# EAGLE design t (EAGLE 7.1.0)
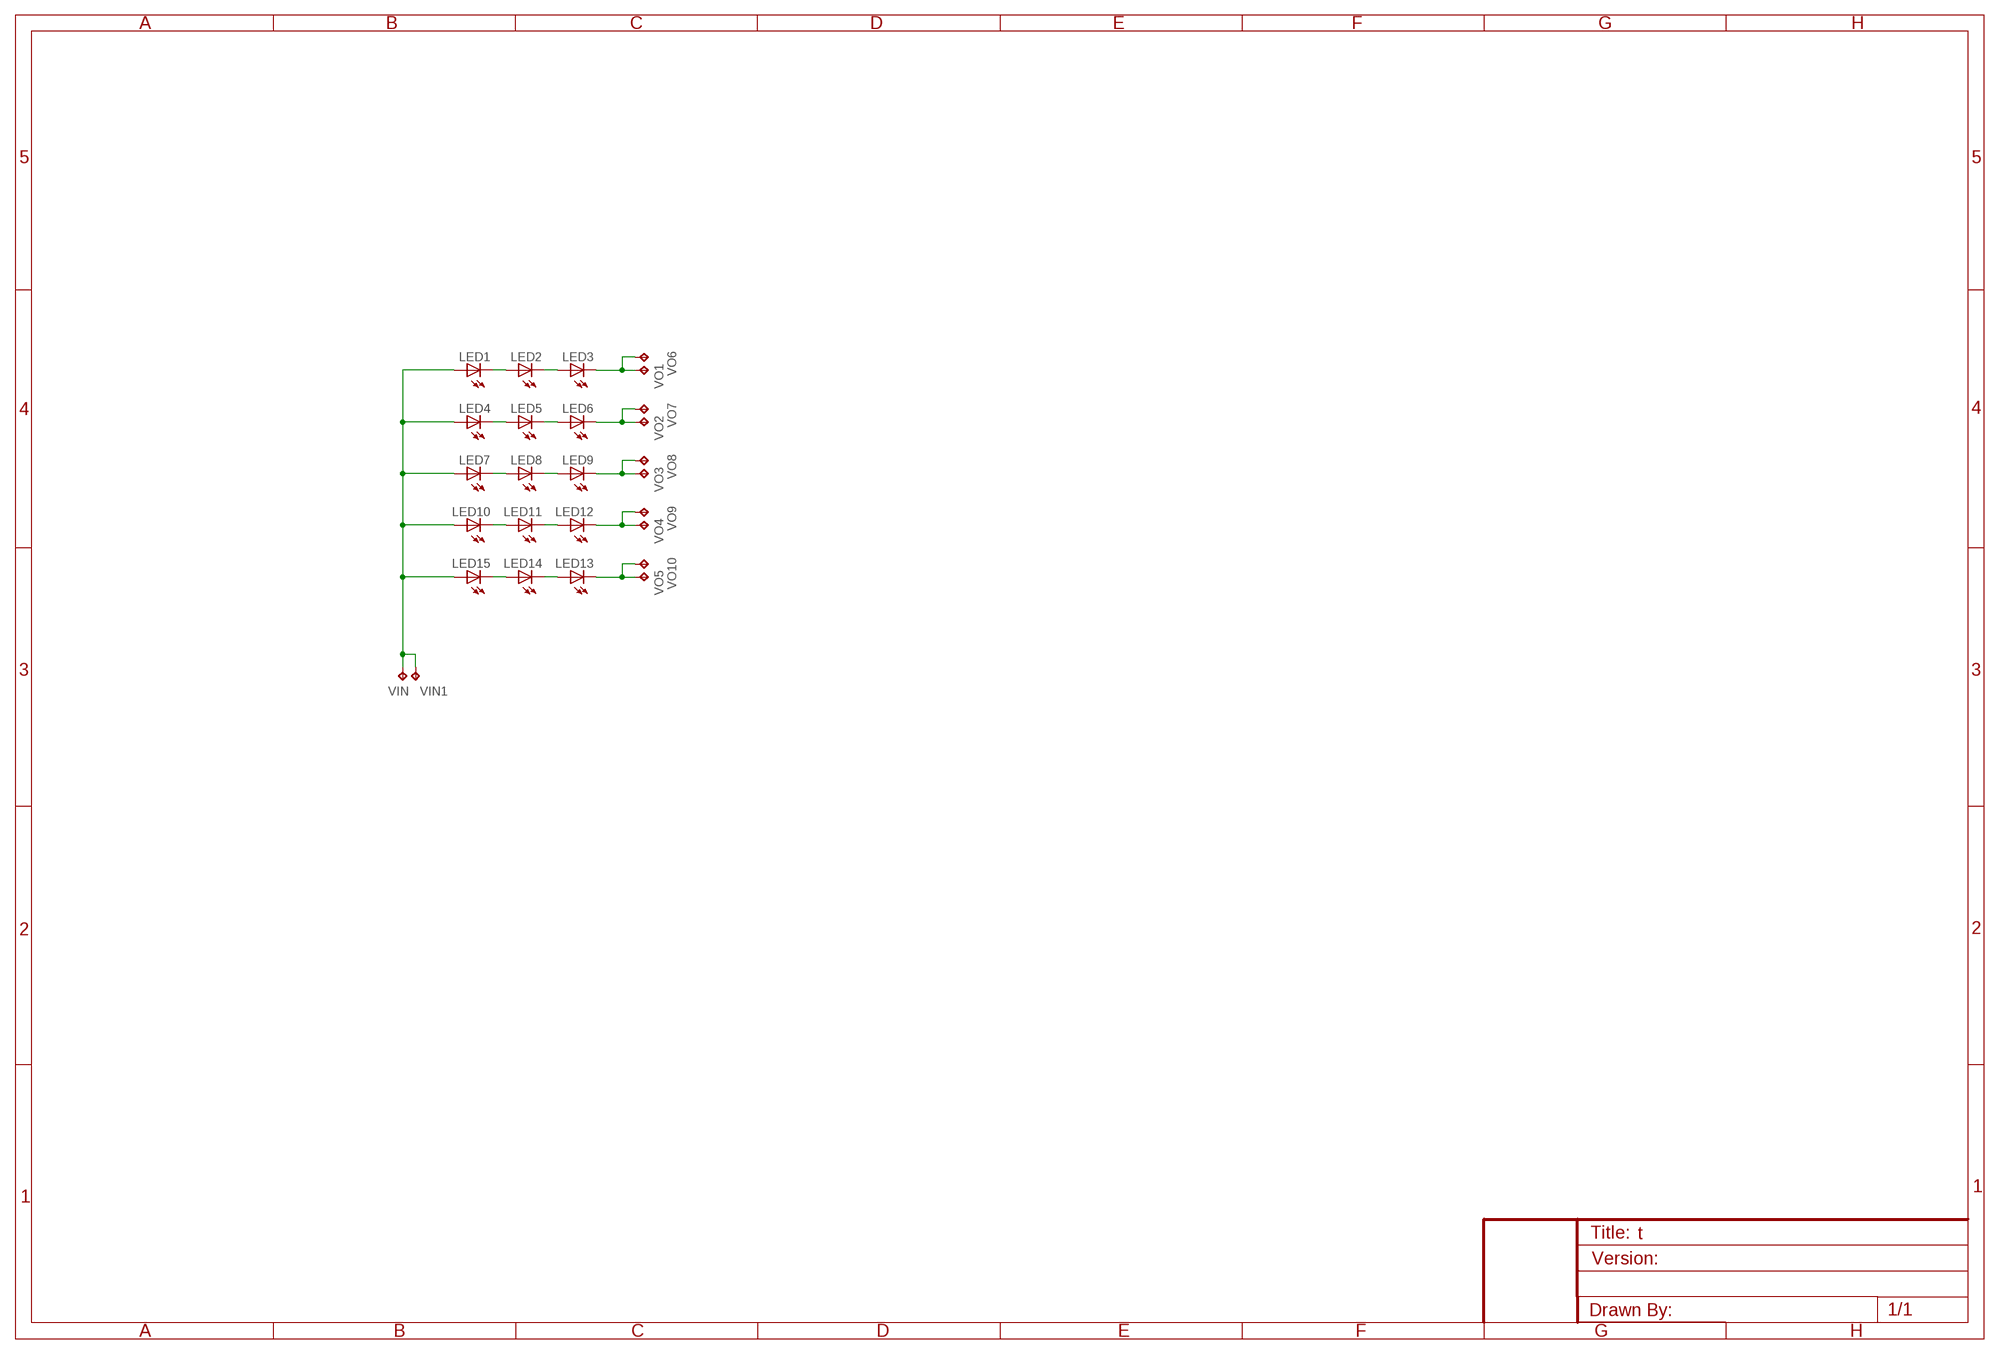
[diagram p0: schematic, sheet 1]

## Parts
LED1  LED0805  [LED_0805]
LED2  LED0805  [LED_0805]
LED3  LED0805  [LED_0805]
LED4  LED0805  [LED_0805]
LED5  LED0805  [LED_0805]
LED6  LED0805  [LED_0805]
LED7  LED0805  [LED_0805]
LED8  LED0805  [LED_0805]
LED9  LED0805  [LED_0805]
LED10  LED0805  [LED_0805]
LED11  LED0805  [LED_0805]
LED12  LED0805  [LED_0805]
LED13  LED0805  [LED_0805]
LED14  LED0805  [LED_0805]
LED15  LED0805  [LED_0805]
VIN  TEST_POINTPAD1-20  [P1-20]
VIN1  TEST_POINTPAD1-20  [P1-20]
VO1  TEST_POINTPAD1-20  [P1-20]
VO2  TEST_POINTPAD1-20  [P1-20]
VO3  TEST_POINTPAD1-20  [P1-20]
VO4  TEST_POINTPAD1-20  [P1-20]
VO5  TEST_POINTPAD1-20  [P1-20]
VO6  TEST_POINTPAD1-20  [P1-20]
VO7  TEST_POINTPAD1-20  [P1-20]
VO8  TEST_POINTPAD1-20  [P1-20]
VO9  TEST_POINTPAD1-20  [P1-20]
VO10  TEST_POINTPAD1-20  [P1-20]

## Nets
N$1: LED13.A LED14.C
N$2: LED14.A LED15.C
N$65: LED2.C LED3.A
N$66: LED1.C LED2.A
N$67: LED5.C LED6.A
N$68: LED4.C LED5.A
N$69: LED8.C LED9.A
N$70: LED7.C LED8.A
N$71: LED11.C LED12.A
N$72: LED10.C LED11.A
VIN: LED1.A LED4.A LED7.A LED10.A LED15.A VIN1.TP VIN.TP
VOUT1: LED3.C VO1.TP VO6.TP
VOUT2: LED6.C VO2.TP VO7.TP
VOUT3: LED9.C VO3.TP VO8.TP
VOUT4: LED12.C VO4.TP VO9.TP
VOUT5: LED13.C VO5.TP VO10.TP

## Library data of the parts
LED1-LED15 = CyberRailGuru:LED: LEDs Standard schematic elements and footprints for 5mm, 3mm, 1206, and 0603 sized LEDs. 5mm - Spark Fun Electronics SKU : COM-00529 (and others)
VIN VIN1 VO1-VO10 = CyberRailGuru:TEST_POINT: Test pad

## Board
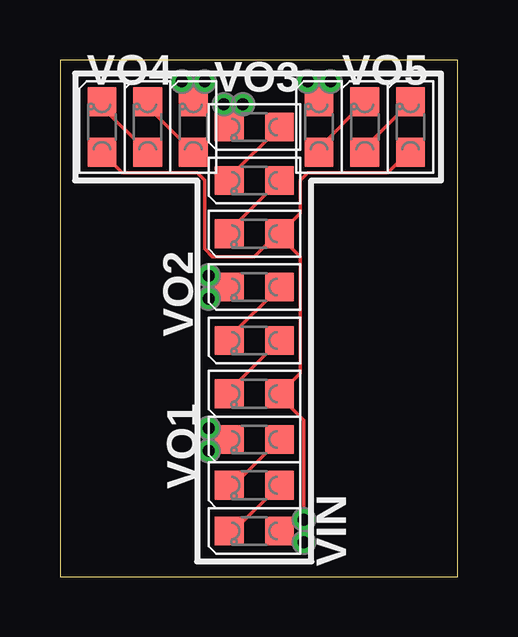
[diagram p1: board, top side]

Size 16.58 x 21.53 mm. Coordinates in mm from the lower left corner, seen from the top.
Outline: 0,0 16.58,0 16.58,21.53 0,21.53 0,0
Copper layers (1*16): Top 0.035mm / dielectric 1.5mm / Bottom 0.035mm
Design rules "Fusion_eagle_rule_v1.1_tms *": minimum track width 6mil, minimum drill 12mil, track to track 6mil, track to pad 6mil, pad to pad 6mil, via to via 6mil, smd to smd 0mil, copper to edge 10mil, drill to drill 10mil, minimum pad ring 10mil, minimum via ring 6mil, stop-mask expansion 2mil, vias tented up to drill 100mil, thermal gap 10mil

### Footprints (pad centres in the part's own frame; a part is rotated, then mirrored left to right if it is on the bottom)
LED_0805 = smd 1.2 x 1.2: A 0,-1.05; C 0,1.05
P1-20 = drill 0.5: TP 0,0

### Placement (x,y rotation side)
LED1  8.1,1.91 90 top
LED2  8.1,3.81 90 top
LED3  8.1,5.72 90 top
LED4  8.1,7.62 90 top
LED5  8.1,9.84 90 top
LED6  8.1,12.07 90 top
LED7  8.1,14.29 90 top
LED8  8.1,16.51 90 top
LED9  8.1,18.73 90 top
LED10  1.75,18.73 0 top
LED11  3.65,18.73 0 top
LED12  5.56,18.73 0 top
LED13  10.79,18.73 0 top
LED14  12.7,18.73 0 top
LED15  14.61,18.73 0 top
VIN  10.16,1.43 0 top
VIN1  10.16,2.38 0 top
VO1  6.19,5.24 0 top
VO2  6.19,11.59 0 top
VO3  6.83,19.69 0 top
VO4  5.08,20.64 0 top
VO5  10.32,20.64 0 top
VO6  6.19,6.19 0 top
VO7  6.19,12.54 0 top
VO8  7.62,19.69 0 top
VO9  6.03,20.64 0 top
VO10  11.27,20.64 0 top

### Tracks (layer width: path | path; a pad name or v marks a point on that pad's centre or on a via)
N$1
  Top 0.152: LED13.A 10.79,17.88 LED14.C
N$2
  Top 0.152: LED14.A 12.7,17.88 LED15.C
N$65
  Top 0.152: LED2.C 7.24,3.81 LED3.A
N$66
  Top 0.152: LED1.C 7.24,1.91 LED2.A
N$67
  Top 0.152: LED5.C 7.05,9.97 LED6.A
N$68
  Top 0.152: LED4.C 7.05,7.74 LED5.A
N$69
  Top 0.152: LED8.C 7.05,16.63 LED9.A
N$70
  Top 0.152: LED7.C 7.05,14.41 LED8.A
N$71
  Top 0.152: LED11.C 3.65,19.59 LED12.A
N$72
  Top 0.152: LED10.C 1.75,19.59 LED11.A
VIN
  Top 0.152: LED15.A 14.51,17.68 13.65,16.83 10.32,16.83 10,16.51 10,15.14 LED7.A | LED7.A 9.15,14.19 10,13.34 10,8.48 LED4.A 9.15,7.52 10.16,6.51 VIN1.TP VIN.TP 9.62,1.43 LED1.A | LED7.A 9.05,14.29 8.1,13.34 6.35,13.34 6.03,13.65 6.03,16.51 5.71,16.83 2.6,16.83 LED10.A
VOUT1
  Top 0.152: LED3.C 6.57,5.24 VO1.TP VO6.TP
VOUT2
  Top 0.152: LED6.C 6.57,11.59 VO2.TP VO7.TP
VOUT3
  Top 0.152: 7.14,18.83 LED9.C 6.83,18.95 VO3.TP VO8.TP
VOUT4
  Top 0.152: LED12.C 5.08,20.26 VO4.TP VO9.TP
VOUT5
  Top 0.152: LED13.C 10.32,20.26 VO5.TP VO10.TP

### Text on the board
201bmp: T